# Altium schematic sheet Stiralka.SchDoc
size A3
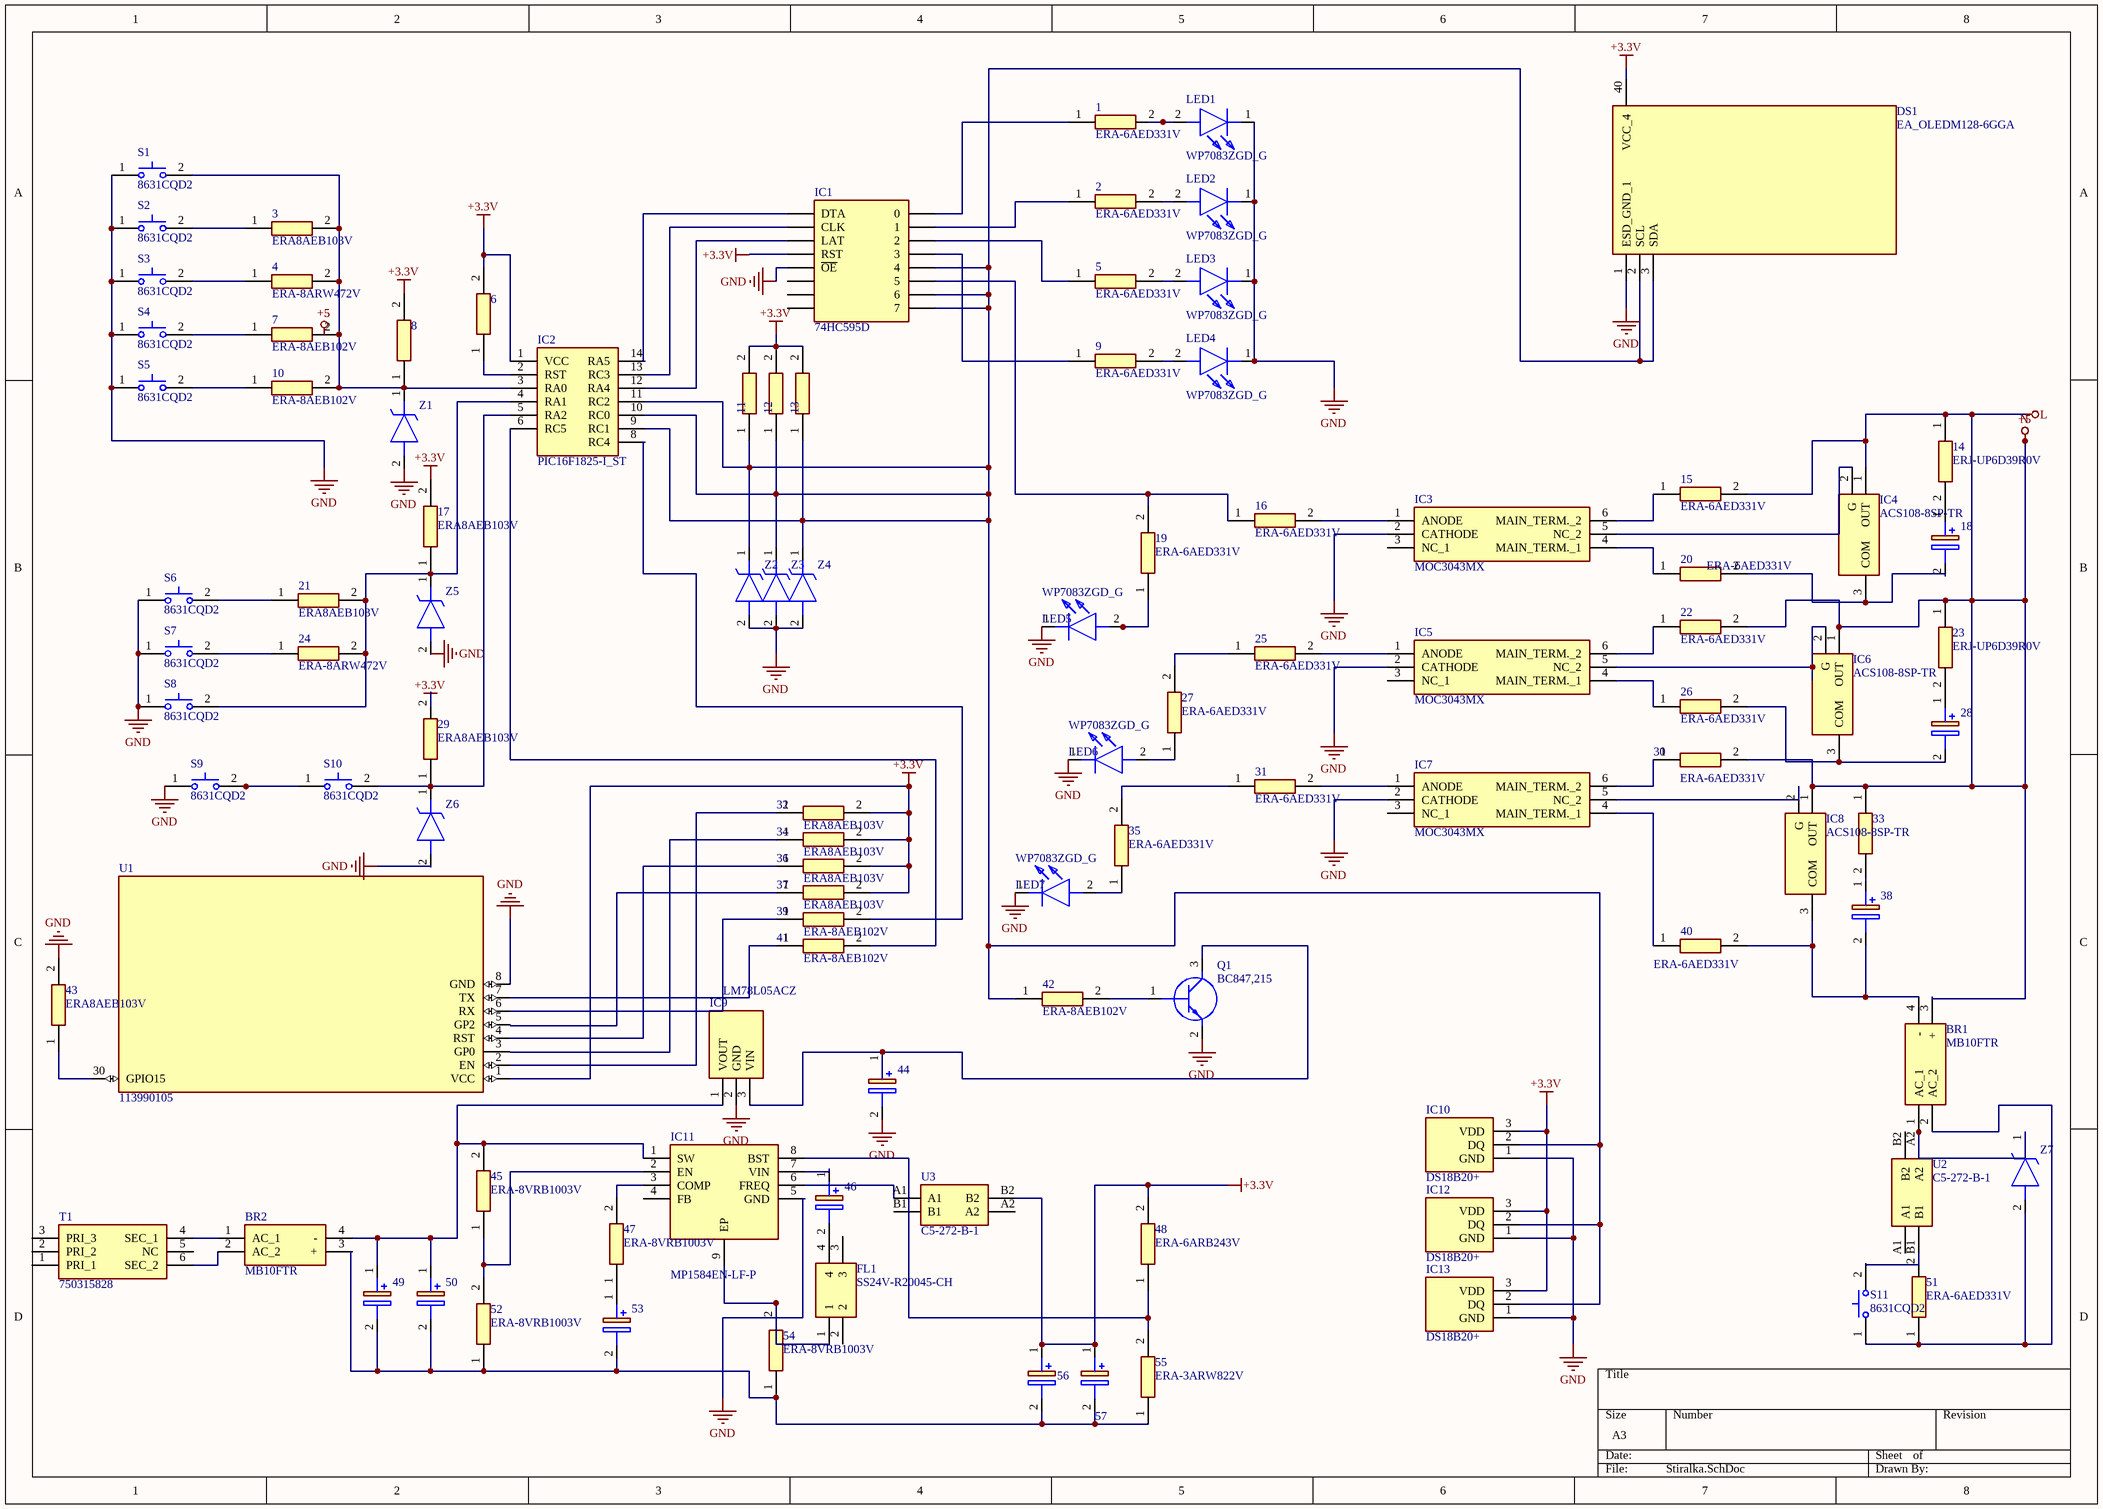
[diagram p0: Stiralka.SchDoc]

## Parts
1  ERA-6AED331V  [ERA6AEB1020V]
2  ERA-6AED331V  [ERA6AEB1020V]
3  ERA8AEB103V  [RESC3216X70N]
4  ERA-8ARW472V  [RESC3216X70N]
5  ERA-6AED331V  [ERA6AEB1020V]
6  ERA8AEB103V  [RESC3216X70N]  (value not drawn)
7  ERA-8AEB102V  [RESC3216X70N]
8  ERA8AEB103V  [RESC3216X70N]  (value not drawn)
9  ERA-6AED331V  [ERA6AEB1020V]
10  ERA-8AEB102V  [RESC3216X70N]
11  RA-8ARW472V  [RESC3216X70N]  (value not drawn)
12  ERA-8ARW472V  [RESC3216X70N]  (value not drawn)
13  ERA-8ARW472V  [RESC3216X70N]  (value not drawn)
14  ERJ-UP6D39R0V  [ERJUP6]
15  ERA-6AED331V  [ERA6AEB1020V]
16  ERA-6AED331V  [ERA6AEB1020V]
17  ERA8AEB103V  [RESC3216X70N]
18  UWP1H0R1MCL1GB  [CAPAE430X550N]  (value not drawn)
19  ERA-6AED331V  [ERA6AEB1020V]
20  ERA-6AED331V  [ERA6AEB1020V]
21  ERA8AEB103V  [RESC3216X70N]
22  ERA-6AED331V  [ERA6AEB1020V]
23  ERJ-UP6D39R0V  [ERJUP6]
24  ERA-8ARW472V  [RESC3216X70N]
25  ERA-6AED331V  [ERA6AEB1020V]
26  ERA-6AED331V  [ERA6AEB1020V]
27  ERA-6AED331V  [ERA6AEB1020V]
28  UWP1H0R1MCL1GB  [CAPAE430X550N]  (value not drawn)
29  ERA8AEB103V  [RESC3216X70N]
30  ERA-6AED331V  [ERA6AEB1020V]
31  ERA-6AED331V  [ERA6AEB1020V]
32  ERA8AEB103V  [RESC3216X70N]
33  ERJ-UP6D39R0V  [ERJUP6]  (value not drawn)
34  ERA8AEB103V  [RESC3216X70N]
35  ERA-6AED331V  [ERA6AEB1020V]
36  ERA8AEB103V  [RESC3216X70N]
37  ERA8AEB103V  [RESC3216X70N]
38  UWP1H0R1MCL1GB  [CAPAE430X550N]  (value not drawn)
39  ERA-8AEB102V  [RESC3216X70N]
40  ERA-6AED331V  [ERA6AEB1020V]
41  ERA-8AEB102V  [RESC3216X70N]
42  ERA-8AEB102V  [RESC3216X70N]
43  ERA8AEB103V  [RESC3216X70N]
44  EEE-FN1H100UR  [EEE1AA220WR]  (value not drawn)
45  ERA-8VRB1003V  [ERA8KEB1004V]
46  EEE-FN1H100UR  [EEE1AA220WR]  (value not drawn)
47  ERA-8VRB1003V  [ERA8KEB1004V]
48  ERA-6ARB243V  [ERA6AEB1020V]
49  EEE-FN1H100UR  [EEE1AA220WR]  (value not drawn)
50  EEE-FT1C102AP  [EEE0JA152UAP]  (value not drawn)
51  ERA-6AED331V  [ERA6AEB1020V]
52  ERA-8VRB1003V  [ERA8KEB1004V]
53  EEE-FN1H100UR  [EEE1AA220WR]  (value not drawn)
54  ERA-8VRB1003V  [ERA8KEB1004V]
55  ERA-3ARW822V  [ERA3AEB101V]
56  EEE-FN1H100UR  [EEE1AA220WR]  (value not drawn)
57  EEE-FT1C102AP  [EEE0JA152UAP]  (value not drawn)
BR1  MB10FTR  [SOP250P670X160-4N]
BR2  MB10FTR  [SOP250P670X160-4N]
DS1  EA_OLEDM128-6GGA  [EAOLEDM1286GGA]
FL1  SS24V-R20045-CH  [SS24VR20045CH]
IC1  74HC595D  [SOIC127P600X175-16N]
IC2  PIC16F1825-I_ST  [SOP65P640X120-14N]
IC3  MOC3043MX  [DIP762W51P254L851H508Q6N]
IC4  ACS108-8SP-TR  [ACS1088SPTR]
IC5  MOC3043MX  [DIP762W51P254L851H508Q6N]
IC6  ACS108-8SP-TR  [ACS1088SPTR]
IC7  MOC3043MX  [DIP762W51P254L851H508Q6N]
IC8  ACS108-8SP-TR  [ACS1088SPTR]
IC9  LM78L05ACZ  [LM78L05ACZ]
IC10  DS18B20+  [DS18B20]
IC11  MP1584EN-LF-P  [SOIC127P600X170-9N]
IC12  DS18B20+  [DS18B20]
IC13  DS18B20+  [DS18B20]
LED1  WP7083ZGD_G  [L53ND]
LED2  WP7083ZGD_G  [L53ND]
LED3  WP7083ZGD_G  [L53ND]
LED4  WP7083ZGD_G  [L53ND]
LED5  WP7083ZGD_G  [L53ND]
LED6  WP7083ZGD_G  [L53ND]
LED7  WP7083ZGD_G  [L53ND]
Q1  BC847,215  [BC847215]
S1  8631CQD2  [8631CQD2]
S2  8631CQD2  [8631CQD2]
S3  8631CQD2  [8631CQD2]
S4  8631CQD2  [8631CQD2]
S5  8631CQD2  [8631CQD2]
S6  8631CQD2  [8631CQD2]
S7  8631CQD2  [8631CQD2]
S8  8631CQD2  [8631CQD2]
S9  8631CQD2  [8631CQD2]
S10  8631CQD2  [8631CQD2]
S11  8631CQD2  [8631CQD2]
T1  750315828  [750315828]
U1  113990105  [113990105]
U2  C5-272-B-1  [C5272B1]
U3  C5-272-B-1  [C5272B1]
Z1  SZMM3Z18VT1G  [SOD2512X110N]  (value not drawn)
Z2  SZMM3Z18VT1G  [SOD2512X110N]  (value not drawn)
Z3  SZMM3Z18VT1G  [SOD2512X110N]  (value not drawn)
Z4  SZMM3Z18VT1G  [SOD2512X110N]  (value not drawn)
Z5  SZMM3Z18VT1G  [SOD2512X110N]  (value not drawn)
Z6  SZMM3Z18VT1G  [SOD2512X110N]  (value not drawn)
Z7  SZMM3Z18VT1G  [SOD2512X110N]  (value not drawn)

## Nets
+3.3V: 6.2 8.2 11.2 12.2 13.2 17.2 29.2 32.2 34.2 36.2 37.2 48.2 56.1(+) 57.1(+) DS1.40(VCC_4) IC1.12(RST) IC2.1(VCC) IC10.3(VDD) IC12.3(VDD) IC13.3(VDD) U1.1(VCC) U3.B2
+5: 14.1 15.2 22.2 23.1 30.2 33.1 BR1.3(+) IC4.1(OUT) IC6.1(OUT) IC8.1(OUT)  [also labelled L, N]
GND: 43.2 44.2(-) DS1.1(ESD_GND_1) IC1.13(~{OE}) IC3.2(CATHODE) IC5.2(CATHODE) IC7.2(CATHODE) IC9.2(GND) IC10.1(GND) IC11.5(GND) IC12.1(GND) IC13.1(GND) LED1.1(K) LED2.1(K) LED3.1(K) LED4.1(K) LED5.1(K) LED6.1(K) LED7.1(K) Q1.2(E) S1.1(N.O._1) S2.1(N.O._1) S3.1(N.O._1) S4.1(N.O._1) S5.1(N.O._1) S6.1(N.O._1) S7.1(N.O._1) S8.1(N.O._1) S9.1(N.O._1) U1.8(GND) Z1.2(A) Z2.2(A) Z3.2(A) Z4.2(A) Z5.2(A) Z6.2(A)
Net1_1: 1.1 IC1.8(0)
Net1_2: 1.2 LED1.2(A)
Net2_1: 2.1 IC1.7(1)
Net2_2: 2.2 LED2.2(A)
Net3_1: 3.1 S2.2(N.O._2)
Net3_2: 3.2 4.2 7.2 8.1 10.2 IC2.3(RA0) S1.2(N.O._2) Z1.1(K)
Net4_1: 4.1 S3.2(N.O._2)
Net5_1: 5.1 IC1.6(2)
Net5_2: 5.2 LED3.2(A)
Net6_1: 6.1 IC2.2(RST)
Net7_1: 7.1 S4.2(N.O._2)
Net9_1: 9.1 IC1.5(3)
Net9_2: 9.2 LED4.2(A)
Net10_1: 10.1 S5.2(N.O._2)
Net11_1: 11.1 12.1 13.1 42.1 DS1.2(SCL) DS1.3(SDA) IC1.1(7) IC1.2(6) IC1.4 IC2.9(RC1) IC2.10(RC0) IC2.11(RC2) IC10.2(DQ) IC12.2(DQ) IC13.2(DQ) Z2.1(K) Z3.1(K) Z4.1(K)
Net14_2: 14.2 18.1(+)
Net15_1: 15.1 IC3.6(MAIN_TERM._2)
Net16_1: 16.1 19.2 IC1.3(5)
Net16_2: 16.2 IC3.1(ANODE)
Net17_1: 17.1 21.2 24.2 IC2.4(RA1) S8.2(N.O._2) Z5.1(K)
Net18_2: 18.2(-) 20.2 IC4.3(COM)
Net19_1: 19.1 LED5.2(A)
Net20_1: 20.1 IC3.4(MAIN_TERM._1)
Net21_1: 21.1 S6.2(N.O._2)
Net22_1: 22.1 IC5.6(MAIN_TERM._2)
Net23_2: 23.2 28.1(+)
Net24_1: 24.1 S7.2(N.O._2)
Net25_1: 25.1 27.2
Net25_2: 25.2 IC5.1(ANODE)
Net26_1: 26.1 IC5.4(MAIN_TERM._1)
Net26_2: 26.2 28.2(-) IC6.3(COM)
Net27_1: 27.1 LED6.2(A)
Net29_1: 29.1 IC2.5(RA2) S10.2(N.O._2) Z6.1(K)
Net30_1: 30.1 IC7.6(MAIN_TERM._2)
Net31_1: 31.1 35.2
Net31_2: 31.2 IC7.1(ANODE)
Net32_1: 32.1 U1.2(EN)
Net33_2: 33.2 38.1(+)
Net34_1: 34.1 U1.3(GP0)
Net35_1: 35.1 LED7.2(A)
Net36_1: 36.1 U1.4(RST)
Net37_1: 37.1 U1.5(GP2)
Net38_2: 38.2(-) 40.2 BR1.4(-) IC8.3(COM)
Net39_1: 39.1 U1.6(RX)
Net39_2: 39.2 IC2.8(RC4)
Net40_1: 40.1 IC7.4(MAIN_TERM._1)
Net41_1: 41.1 U1.7(TX)
Net41_2: 41.2 IC2.6(RC5)
Net42_2: 42.2 Q1.1(B)
Net43_1: 43.1 U1.30(GPIO15)
Net44_1: 44.1(+) IC9.3(VIN) Q1.3(C)
Net45_1: 45.1 52.2 IC11.2(EN)
Net45_2: 45.2 49.1(+) 50.1(+) BR2.4(-) IC9.1(VOUT) IC11.1(SW)
Net46_1: 46.1(+) IC11.7(VIN)
Net46_2: 46.2(-) FL1.4
Net47_1: 47.1 53.1(+)
Net47_2: 47.2 IC11.3(COMP)
Net48_1: 48.1 55.2 IC11.8(BST)
Net49_2: 49.2(-) 50.2(-) 52.1 53.2(-) 54.1 55.1 56.2(-) 57.2(-) BR2.3(+)
Net51_1: 51.1 BR1.2(AC_2) S11.1(N.O._1) Z7.2(A)
Net54_2: 54.2 FL1.1 IC11.9(EP)
NetBR1_1: BR1.1(AC_1) U2.A2 Z7.1(K)
NetBR2_1: BR2.1(AC_1) T1.4(SEC_1)
NetBR2_2: BR2.2(AC_2) T1.6(SEC_2)
NetIC1_9: IC1.9(DTA) IC2.14(RA5)
NetIC1_10: IC1.10(CLK) IC2.13(RC3)
NetIC1_11: IC1.11(LAT) IC2.12(RA4)
NetIC3_5: IC3.5(NC_2) IC4.2(G)
NetIC5_5: IC5.5(NC_2) IC6.2(G)
NetIC7_5: IC7.5(NC_2) IC8.2(G)
NetIC11_6: IC11.6(FREQ) U3.A1
NetS9_2: S9.2(N.O._2) S10.1(N.O._1)
NetS11_2: S11.2(N.O._2) U2.B1

Not connected (* = marked no-connect by the designer): 51 2; DS1 18(NC_3) 19(NC_4) 20(ESD_GND_2) 21(VCC_1) 22(VCC_2) 23(GND_1) 24(GND_2) 25(VDD) 26(BS0) 27(BS1) 28(GND_3) 29(CS) 30(RES) 31(D/C) 32(D0) 33(D1) 34(D2) 35(GND_4) 36(IREF) 37(VCOMH_1) 38(VCOMH_2) 39(VCC_3); FL1 2 3; IC1 14(DS) 15(Q0) 16(VCC); IC2 7(RC3); IC3 3(NC_1); IC5 3(NC_1); IC7 3(NC_1); IC11 4(FB); T1 1(PRI_1) 2(PRI_2) 3(PRI_3) 5(NC); U1 9(SPI_CLK_/_SD_CLK) 10(GND_1) 11(VDD3V3_1) 12(EN) 13(NRST) 14(GND_2) 15(VDD5V) 16(VDD3V3_2) 17(GND_3) 18(D10_-_TXD0_/_GPIO1) 19(D9_-__RXD0_/_GPIO3) 20(D8_-_GPIO15_/_TXD2_/_HSPICS) 21(D7_-_GPIO13_/_RXD2_/_HSPID) 22(D6_-_GPIO12_/_HSPIQ) 23(D5_-_GPIO14_/_HSPICLK) 24(GND_4) 25(VDD3V3_3) 26(D4_-_GPIO2_/_TXD1) 27(D3_-_GPIO0) 28(D2_-_GPIO4) 29(D1_-_GPIO5); U2 A1 B2; U3 A2 B1

## Library data of the parts
1 2 5 9 15 16 19 20 22 25-27 30 31 35 40 51 = ERA-6AED331V: Resistor; Manufacturer_Name: Panasonic; Datasheet Link: https://industrial.panasonic.com/cdbs/www-data/pdf/RDM0000/AOA0000C307.pdf; Height: 0.6mm; Manufacturer_Part_Number: ERA-6AED331V; Mouser Part Number: 667-ERA-6AED331V; Mouser Price/Stock: https://www.mouser.co.uk/ProductDetail/Panasonic/ERA-6AED331V?qs=MNPzkKEzRtQuXAC5C6ALEg%3D%3D
3 6 8 17 21 29 32 34 36 37 43 = ERA8AEB103V: Resistor; Manufacturer_Name: Panasonic; Datasheet Link: https://industrial.panasonic.com/cdbs/www-data/pdf/RDM0000/AOA0000C307.pdf; Height: 0.7mm; Manufacturer_Part_Number: ERA8AEB103V; Arrow Part Number: ERA8AEB103V; Arrow Price/Stock: https://www.arrow.com/en/products/era8aeb103v/panasonic
4 11-13 24 = ERA-8ARW472V: Resistor; Manufacturer_Name: Panasonic; Datasheet Link: https://industrial.panasonic.com/cdbs/www-data/pdf/RDM0000/AOA0000C307.pdf; Height: 0.7mm; Manufacturer_Part_Number: ERA-8ARW472V; Mouser Part Number: 667-ERA-8ARW472V; Mouser Price/Stock: https://www.mouser.co.uk/ProductDetail/Panasonic/ERA-8ARW472V?qs=O13OCoPxAUXSgPN5fRomwA%3D%3D
7 10 39 41 42 = ERA-8AEB102V: Resistor; Manufacturer_Name: Panasonic; Datasheet Link: https://industrial.panasonic.com/cdbs/www-data/pdf/RDM0000/AOA0000C307.pdf; Height: 0.7mm; Manufacturer_Part_Number: ERA-8AEB102V; Mouser Part Number: 667-ERA-8AEB102V; Mouser Price/Stock: https://www.mouser.co.uk/ProductDetail/Panasonic/ERA-8AEB102V?qs=Ojoo2rCVP9R3RwZw0XjknA%3D%3D; Arrow Part Number: ERA-8AEB102V; Arrow Price/Stock: https://www.arrow.com/en/products/era-8aeb102v/panasonic?region=nac
14 23 33 = ERJ-UP6D39R0V: Resistor; Manufacturer_Name: Panasonic; Datasheet Link: https://industrial.panasonic.com/cdbs/www-data/pdf/RDP0000/AOA0000C337.pdf; Height: 0.7mm; Manufacturer_Part_Number: ERJ-UP6D39R0V
18 28 38 = UWP1H0R1MCL1GB: Capacitor Polarised; Manufacturer_Name: Nichicon; Datasheet Link: https://products.nichicon.co.jp/en/part_search/part_list.cfm#; Height: 5.5mm; Manufacturer_Part_Number: UWP1H0R1MCL1GB; Mouser Part Number: 647-UWP1H0R1MCL; Mouser Price/Stock: https://www.mouser.co.uk/ProductDetail/Nichicon/UWP1H0R1MCL1GB?qs=2FehpBK1j949z1DlrKLaeA%3D%3D; Arrow Part Number: UWP1H0R1MCL1GB; Arrow Price/Stock: https://www.arrow.com/en/products/uwp1h0r1mcl1gb/nichicon?region=nac
44 46 49 53 56 = EEE-FN1H100UR: Capacitor Polarised; Manufacturer_Name: Panasonic; Datasheet Link: http://industrial.panasonic.com/cdbs/www-data/pdf/RDE0000/RDE0000C1259.pdf; Height: 5.5mm; Manufacturer_Part_Number: EEE-FN1H100UR; Mouser Part Number: 667-EEE-FN1H100UR; Mouser Price/Stock: https://www.mouser.co.uk/ProductDetail/Panasonic/EEE-FN1H100UR?qs=OlC7AqGiEDk6TNrf%252B9WfXA%3D%3D; Arrow Part Number: EEE-FN1H100UR; Arrow Price/Stock: https://www.arrow.com/en/products/eee-fn1h100ur/panasonic
45 47 52 54 = ERA-8VRB1003V: Resistor; Manufacturer_Name: Panasonic; Datasheet Link: https://industrial.panasonic.com/cdbs/www-data/pdf/RDM0000/RDM0000C331.pdf; Height: 0.65mm; Manufacturer_Part_Number: ERA-8VRB1003V; Mouser Part Number: 667-ERA-8VRB1003V; Mouser Price/Stock: https://www.mouser.co.uk/ProductDetail/Panasonic/ERA-8VRB1003V?qs=By6Nw2ByBD3GbaEFFbsd4A%3D%3D
48 = ERA-6ARB243V: Resistor; Manufacturer_Name: Panasonic; Datasheet Link: https://industrial.panasonic.com/cdbs/www-data/pdf/RDM0000/AOA0000C307.pdf; Height: 0.6mm; Manufacturer_Part_Number: ERA-6ARB243V; Mouser Part Number: 667-ERA-6ARB243V; Mouser Price/Stock: https://www.mouser.co.uk/ProductDetail/Panasonic/ERA-6ARB243V?qs=ob%252BdNz2%252BYEjYlBhwN4NogQ%3D%3D
50 57 = EEE-FT1C102AP: Capacitor Polarised; Manufacturer_Name: Panasonic; Datasheet Link: http://industrial.panasonic.com/cdbs/www-data/pdf/RDE0000/ABA0000C1240.pdf; Height: 12mm; Manufacturer_Part_Number: EEE-FT1C102AP; Mouser Part Number: 667-EEE-FT1C102AP; Mouser Price/Stock: https://www.mouser.co.uk/ProductDetail/Panasonic/EEE-FT1C102AP?qs=1Gb%2FpduDpOD%252BHxkmfupuSQ%3D%3D; Arrow Part Number: EEE-FT1C102AP; Arrow Price/Stock: https://www.arrow.com/en/products/eee-ft1c102ap/panasonic?region=nac
55 = ERA-3ARW822V: Resistor; Manufacturer_Name: Panasonic; Datasheet Link: https://industrial.panasonic.com/cdbs/www-data/pdf/RDM0000/AOA0000C307.pdf; Height: 0.55mm; Manufacturer_Part_Number: ERA-3ARW822V; Mouser Part Number: 667-ERA-3ARW822V; Mouser Price/Stock: https://www.mouser.co.uk/ProductDetail/Panasonic/ERA-3ARW822V?qs=ob%252BdNz2%252BYEhnfLdVZWTjCg%3D%3D
BR1 BR2 = MB10FTR: Bridge Rectifier; Manufacturer_Name: SMC Diode Solutions; Datasheet Link: http://www.smc-diodes.com/propdf/MB05F-MB10F%20N1456%20REV.A.pdf; Height: 1.6mm; Manufacturer_Part_Number: MB10FTR
DS1 = EA_OLEDM128-6GGA: Display; Manufacturer_Name: Display Visions; Manufacturer_Part_Number: EA OLEDM128-6GGA; Datasheet Link: https://datasheet.datasheetarchive.com/originals/distributors/DKDS42/DSANUWW0045097.pdf; Height: 3.3mm; Mouser Part Number: 790-EAOLEDM1286GGA; Mouser Price/Stock: https://www.mouser.co.uk/ProductDetail/Display-Visions/EA-OLEDM128-6GGA?qs=w%2Fv1CP2dgqoi%252BGCQnyUORg%3D%3D
FL1 = SS24V-R20045-CH: Filter; Manufacturer_Name: KEMET; Datasheet Link: https://componentsearchengine.com/Datasheets/1/SS24V-R20045-CH.pdf; Height: 31.5mm; Manufacturer_Part_Number: SS24V-R20045-CH; Mouser Part Number: 80-SS24V-R20045-CH; Mouser Price/Stock: https://www.mouser.co.uk/ProductDetail/KEMET/SS24V-R20045-CH?qs=BenOyfdfArrs26rWIWCkwQ%3D%3D; Arrow Part Number: SS24V-R20045-CH; Arrow Price/Stock: https://www.arrow.com/en/products/ss24v-r20045-ch/kemet-corporation
IC1 = 74HC595D: Integrated Circuit; Manufacturer_Name: NXP; Datasheet Link: https://assets.nexperia.com/documents/data-sheet/74HC_HCT595.pdf; Height: 1.75mm; Manufacturer_Part_Number: 74HC595D; Mouser Part Number: N/A; Mouser Price/Stock: https://www.mouser.co.uk/ProductDetail/NXP-Semiconductors/74HC595D?qs=KBAwV6Cvgt0f%252BALigJeNTw%3D%3D
IC2 = PIC16F1825-I_ST: Integrated Circuit; Manufacturer_Name: Microchip; Manufacturer_Part_Number: PIC16F1825-I/ST; Datasheet Link: http://ww1.microchip.com/downloads/en/devicedoc/41440a.pdf; Height: 1.2mm; Mouser Part Number: 579-PIC16F1825-I/ST; Mouser Price/Stock: https://www.mouser.co.uk/ProductDetail/Microchip-Technology/PIC16F1825-I-ST?qs=up0rdVSEOZT%2F%2FOdDBOXkWg%3D%3D; Arrow Part Number: PIC16F1825-I/ST; Arrow Price/Stock: https://www.arrow.com/en/products/pic16f1825-ist/microchip-technology?region=europe
IC3 IC5 IC7 = MOC3043MX: Integrated Circuit; Manufacturer_Name: onsemi; Datasheet Link: http://uk.rs-online.com/web/p/products/6711434; Height: 5.08mm; Manufacturer_Part_Number: MOC3043MX
IC4 IC6 IC8 = ACS108-8SP-TR: Integrated Circuit; Manufacturer_Name: STMicroelectronics; Datasheet Link: https://www.st.com/resource/en/datasheet/acs108-8sp.pdf; Height: 1.8mm; Manufacturer_Part_Number: ACS108-8SP-TR; Mouser Part Number: 511-ACS108-8SP-TR; Mouser Price/Stock: https://www.mouser.co.uk/ProductDetail/STMicroelectronics/ACS108-8SP-TR?qs=pBunHO6%252BwtF6H7n0e1joeA%3D%3D
IC9 = LM78L05ACZ: Integrated Circuit; Manufacturer_Name: Texas Instruments; Datasheet Link: https://www.ti.com/lit/ds/symlink/lm78l.pdf?ts=1618913652963&ref_url=https%253A%252F%252Fwww.google.com%252F; Height: 5.34mm; Manufacturer_Part_Number: LM78L05ACZ; Mouser Part Number: 926-LM78L05ACZ; Mouser Price/Stock: https://www.mouser.co.uk/ProductDetail/Texas-Instruments/LM78L05ACZ?qs=QbsRYf82W3ENmBo4fe1t6w%3D%3D
IC10 IC12 IC13 = DS18B20+: Integrated Circuit; Manufacturer_Name: Analog Devices; Datasheet Link: https://ms.componentsearchengine.com/Datasheets/2/DS18B20+.pdf; Height: 4.95mm; Manufacturer_Part_Number: DS18B20+; Mouser Part Number: 700-DS18B20+; Mouser Price/Stock: https://www.mouser.co.uk/ProductDetail/Analog-Devices-Maxim-Integrated/DS18B20%2b?qs=7H2Jq%252ByxpJKegCKabDbglA%3D%3D; Arrow Part Number: DS18B20+; Arrow Price/Stock: null?region=nac
IC11 = MP1584EN-LF-P: Integrated Circuit; Manufacturer_Name: Monolithic Power Systems (MPS); Datasheet Link: https://componentsearchengine.com/Datasheets/1/MP1584EN-LF-P.pdf; Height: 1.7mm; Manufacturer_Part_Number: MP1584EN-LF-P; Mouser Part Number: 946-MP1584EN-LF-P; Mouser Price/Stock: https://www.mouser.co.uk/ProductDetail/Monolithic-Power-Systems-MPS/MP1584EN-LF-P?qs=%252B6g0mu59x7Ie1GinT4nULQ%3D%3D
LED1-LED7 = WP7083ZGD_G: LED; Manufacturer_Name: Kingbright; Manufacturer_Part_Number: WP7083ZGD/G; Datasheet Link: http://www.kingbrightusa.com/images/catalog/SPEC/WP7083ZGD-G.pdf; Height: 8.85mm; Mouser Part Number: 604-WP7083ZGD/G; Mouser Price/Stock: https://www.mouser.co.uk/ProductDetail/Kingbright/WP7083ZGD-G?qs=vEWui5pQpauzaZd%252BFRBkgQ%3D%3D
Q1 = BC847,215: Transistor BJT NPN; Manufacturer_Name: Nexperia; Datasheet Link: https://assets.nexperia.com/documents/data-sheet/BC847_SER.pdf; Height: 1.1mm; Manufacturer_Part_Number: BC847,215; Mouser Part Number: 771-BC847215; Mouser Price/Stock: https://www.mouser.co.uk/ProductDetail/Nexperia/BC847215?qs=me8TqzrmIYWROhdFmDauyQ%3D%3D; Arrow Part Number: BC847,215; Arrow Price/Stock: https://www.arrow.com/en/products/bc847215/nexperia?region=europe
S1-S11 = 8631CQD2: Switch (2-Pin Push); Manufacturer_Name: C & K COMPONENTS; Datasheet Link: https://www.ckswitches.com/media/1396/8600.pdf; Height: 13.93mm; Manufacturer_Part_Number: 8631CQD2; Mouser Part Number: 611-8631-261; Mouser Price/Stock: https://www.mouser.co.uk/ProductDetail/CK/8631CQD2?qs=ktcBc77oICXe9iPhfEwnkA%3D%3D
T1 = 750315828: Transformer; Manufacturer_Name: Wurth Elektronik; Datasheet Link: https://www.we-online.com/catalog/datasheet/750315828.pdf; Height: 8.64mm; Manufacturer_Part_Number: 750315828; Mouser Part Number: 710-750315828; Mouser Price/Stock: https://www.mouser.co.uk/ProductDetail/Wurth-Elektronik/750315828?qs=qSfuJ%252Bfl%2Fd5csOHsZtVquA%3D%3D
U1 = 113990105: Undefined or Miscellaneous; Manufacturer_Name: Seeed Studio; Datasheet Link: https://www.seeedstudio.com/NodeMCU-v2-Lua-based-ESP8266-development-kit.html; Height: 7.35mm; Manufacturer_Part_Number: 113990105; Mouser Part Number: 713-113990105; Mouser Price/Stock: https://www.mouser.co.uk/ProductDetail/Seeed-Studio/113990105?qs=SElPoaY2y5KMx8k1roAIKw%3D%3D; Arrow Part Number: 113990105; Arrow Price/Stock: https://www.arrow.com/en/products/113990105/seeed-technology-limited?region=nac
U2 U3 = C5-272-B-1: Undefined or Miscellaneous; Manufacturer_Name: Johnson Electric; Datasheet Link: https://media.digikey.com/pdf/Data%20Sheets/Emerson%20PDFs/C5-yyy-B-1_2-27-15.pdf; Height: 11.7mm; Manufacturer_Part_Number: C5-272-B-1
Z1-Z7 = SZMM3Z18VT1G: Zener Diode; Manufacturer_Name: onsemi; Datasheet Link: http://www.onsemi.com/pub/Collateral/MM3Z2V4T1-D.PDF; Height: 1.1mm; Manufacturer_Part_Number: SZMM3Z18VT1G; Mouser Part Number: 863-SZMM3Z18VT1G; Mouser Price/Stock: https://www.mouser.co.uk/ProductDetail/onsemi/SZMM3Z18VT1G?qs=PJJcWtbOkNXOO%2F%2FcYXv3xg%3D%3D